# Altium schematic sheet main.SchDoc
size A4; SheetNumber: 1; SheetTotal: 1
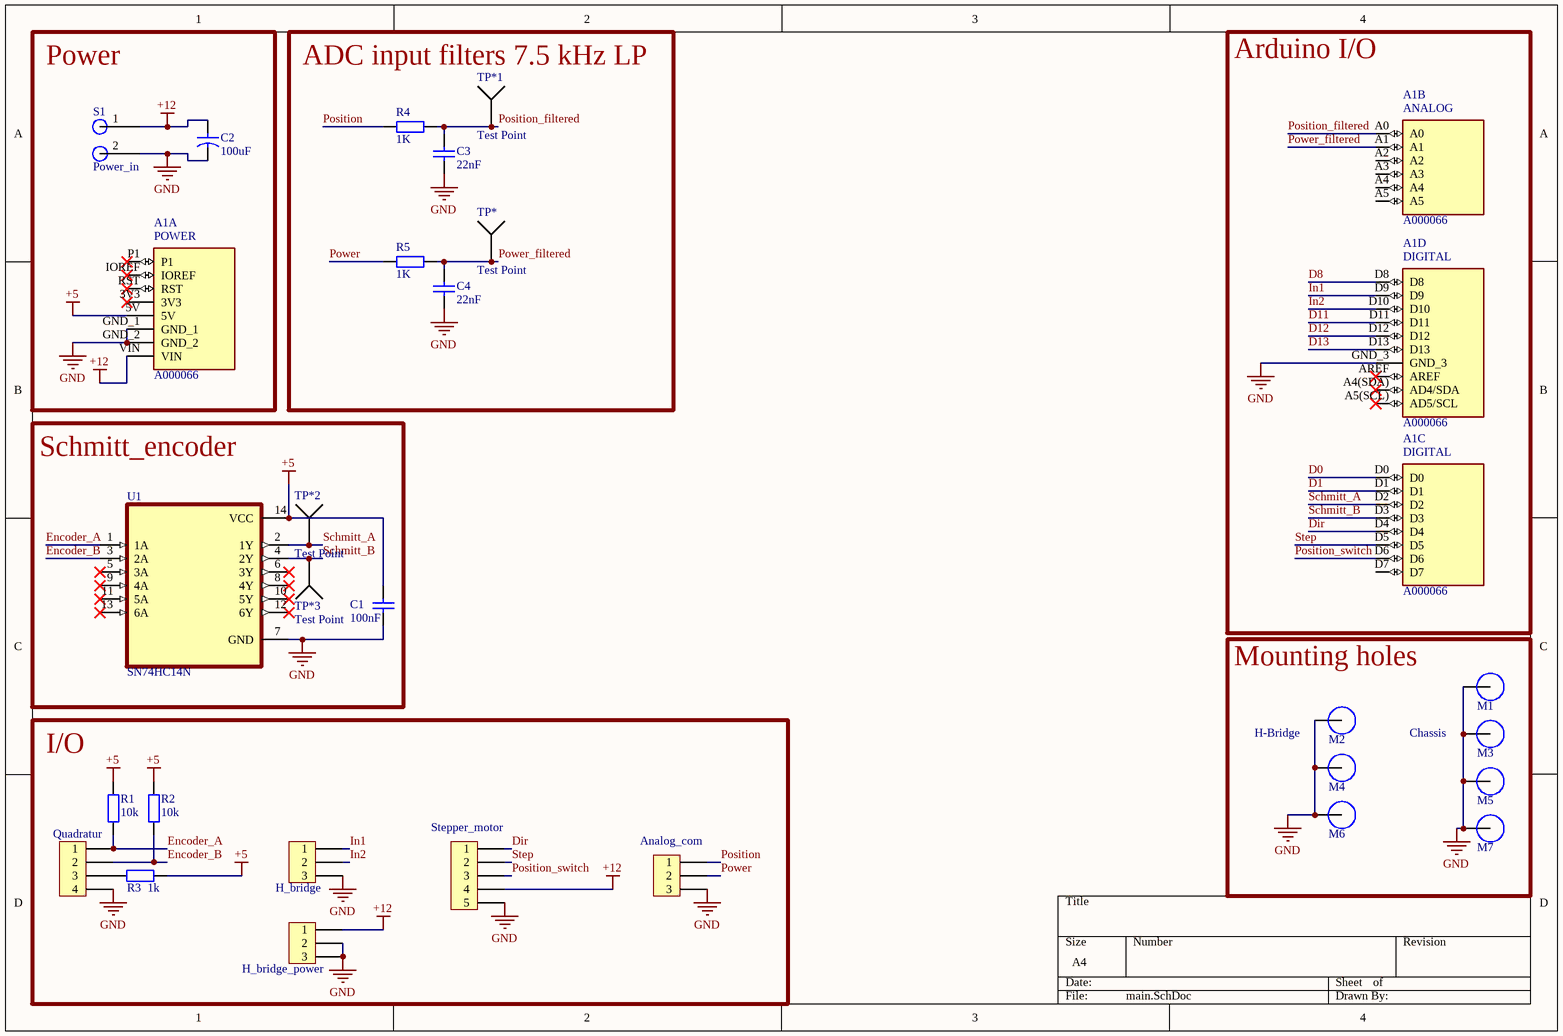
[diagram p0: main.SchDoc]

## Parts
A1  A000066  [ARDUINO_A000066]  (parts A,B,C,D of 4)
Analog_com  Header 1x3  [Header 1x3]  (value not drawn)
C1  value 100nF  [Cap-1]  (hidden comment: Cap)
C2  value 100uF  [Cap Lyt Ø8]  (hidden comment: Cap)
C3  value 22nF  [Cap-1]  (hidden comment: Cap)
C4  value 22nF  [Cap-1]  (hidden comment: Cap)
H_bridge  Header 1x3  [Header 1x3]  (value not drawn)
H_bridge_power  Header 1x3  [Header 1x3]  (value not drawn)
M1  Screw Hole  [M3 Hole]  (value not drawn)  (no BOM)
M2  Screw Hole  [M3 Hole]  (value not drawn)  (no BOM)
M3  Screw Hole  [M3 Hole]  (value not drawn)  (no BOM)
M4  Screw Hole  [M3 Hole]  (value not drawn)  (no BOM)
M5  Screw Hole  [M3 Hole]  (value not drawn)  (no BOM)
M6  Screw Hole  [M3 Hole]  (value not drawn)  (no BOM)
M7  Screw Hole  [M3 Hole]  (value not drawn)  (no BOM)
Quadratur  Header 1x4  [Header 1x4]  (value not drawn)
R1  value 10k  [RES THT 9mm]  (hidden comment: Resistor)
R2  value 10k  [RES THT 9mm]  (hidden comment: Resistor)
R3  value 1k  [RES THT 9mm]  (hidden comment: Resistor)
R4  value 1K  [RES THT 9mm]  (hidden comment: Resistor)
R5  value 1K  [RES THT 9mm]  (hidden comment: Resistor)
S1  Power_in  [Screw-2]
Stepper_motor  Header 1x5  [Header 1x5]  (value not drawn)
TP*  Test Point  [TP_loop_pin_1249]
TP*1  Test Point  [TP_loop_pin_1249]
TP*2  Test Point  [TP_loop_pin_1249]
TP*3  Test Point  [TP_loop_pin_1249]
U1  SN74HC14N  [DIP794W45P254L1969H508Q14]

## Blocks framed on the sheet
Power: A1 C2 S1
ADC input filters 7.5 kHz LP: C3 C4 R4 R5 TP* TP*1
Arduino I/O: A1
Schmitt_encoder: C1 TP*2 TP*3 U1
Mounting holes: M1-M7
I/O: Analog_com H_bridge H_bridge_power Quadratur R1-R3 Stepper_motor

## Nets
+5: A1.5V C1.2(g) R1.2 R2.2 R3.1 U1.14(VCC)
+12: A1.VIN C2.1 H_bridge_power.1 S1.1 Stepper_motor.4
GND: A1.GND_1 A1.GND_2 A1.GND_3 Analog_com.3 C1.1 C2.2(g) C3.1 C4.1 H_bridge.3 H_bridge_power.2 H_bridge_power.3 M1.1 M2.1 M3.1 M4.1 M5.1 M6.1 M7.1 Quadratur.4 S1.2 Stepper_motor.5 U1.7(GND)
D0: A1.D0
D1: A1.D1
D8: A1.D8
D11: A1.D11
D12: A1.D12
D13: A1.D13
Dir: A1.D4 Stepper_motor.1
Encoder_A: Quadratur.1 R1.1 U1.1(1A)
Encoder_B: Quadratur.2 R2.1 U1.3(2A)
In1: A1.D9 H_bridge.1
In2: A1.D10 H_bridge.2
Position: Analog_com.1 R4.1
Position_filtered: A1.A0 C3.2(g) R4.2 TP*1.TP
Position_switch: A1.D6 Stepper_motor.3
Power: Analog_com.2 R5.1
Power_filtered: A1.A1 C4.2(g) R5.2 TP*.TP
Schmitt_A: A1.D2 TP*2.TP U1.2(1Y)
Schmitt_B: A1.D3 TP*3.TP U1.4(2Y)
Step: A1.D5 Stepper_motor.2
NetQuadratur_3: Quadratur.3 R3.2

Not connected (* = marked no-connect by the designer): A1 3V3* A2 A3 A4 A4(SDA)(AD4/SDA)* A5 A5(SCL)(AD5/SCL)* AREF* D7 IOREF* P1* RST*; U1 5(3A)* 6(3Y)* 8(4Y)* 9(4A)* 10(5Y)* 11(5A)* 12(6Y)* 13(6A)*

## Notes on the sheet
- H-Bridge
- Chassis
- (in symbol A000066, part A) POWER
- (in symbol A000066, part B) ANALOG
- (in symbol A000066, part C) DIGITAL
- (in symbol A000066, part D) DIGITAL

## Library data of the parts
A1 = A000066: Microcontroller board based on the ATmega328P.; pin to pad: A4(SDA)>A4(SDA; MF: Arduino; MP: Arduino Uno Rev3; Value: *; SnapEDA_Link: https://www.snapeda.com/parts/Arduino%20Uno%20Rev3/Arduino/view-part/?ref=snap; Availability: Not in stock; Price: None; Package: Non-Standard Arduino; Check_prices: https://www.snapeda.com/parts/Arduino%20Uno%20Rev3/Arduino/view-part/?ref=eda
C1 C3 C4 = Capacitor 1 space
C2 = Capacitor electrolytic
S1 = Screw 2
U1 = SN74HC14N: 6-ch, 2-V to 6-V inverters with Schmitt-Trigger inputs; MF: Texas Instruments; SnapEDA_Link: https://www.snapeda.com/parts/SN74HC14N/Texas+Instruments/view-part/?ref=snap; Package: PDIP-14 Texas Instruments; MP: SN74HC14N; Check_prices: https://www.snapeda.com/parts/SN74HC14N/Texas+Instruments/view-part/?ref=eda; Purchase-URL: https://pricing.snapeda.com/search/part/SN74HC14N/?ref=eda; Price: None; Value: *; Availability: In Stock